# Altium schematic sheet 01_ECU V1.0 B - TOP LEVEL.SchDoc: Interface To Nvidia Orin
size A3; DrawnBy: Elio F; Engineer: Elio F; Revision: A; SheetNumber: 2; SheetTotal: 24; Sheet Title: Top Level
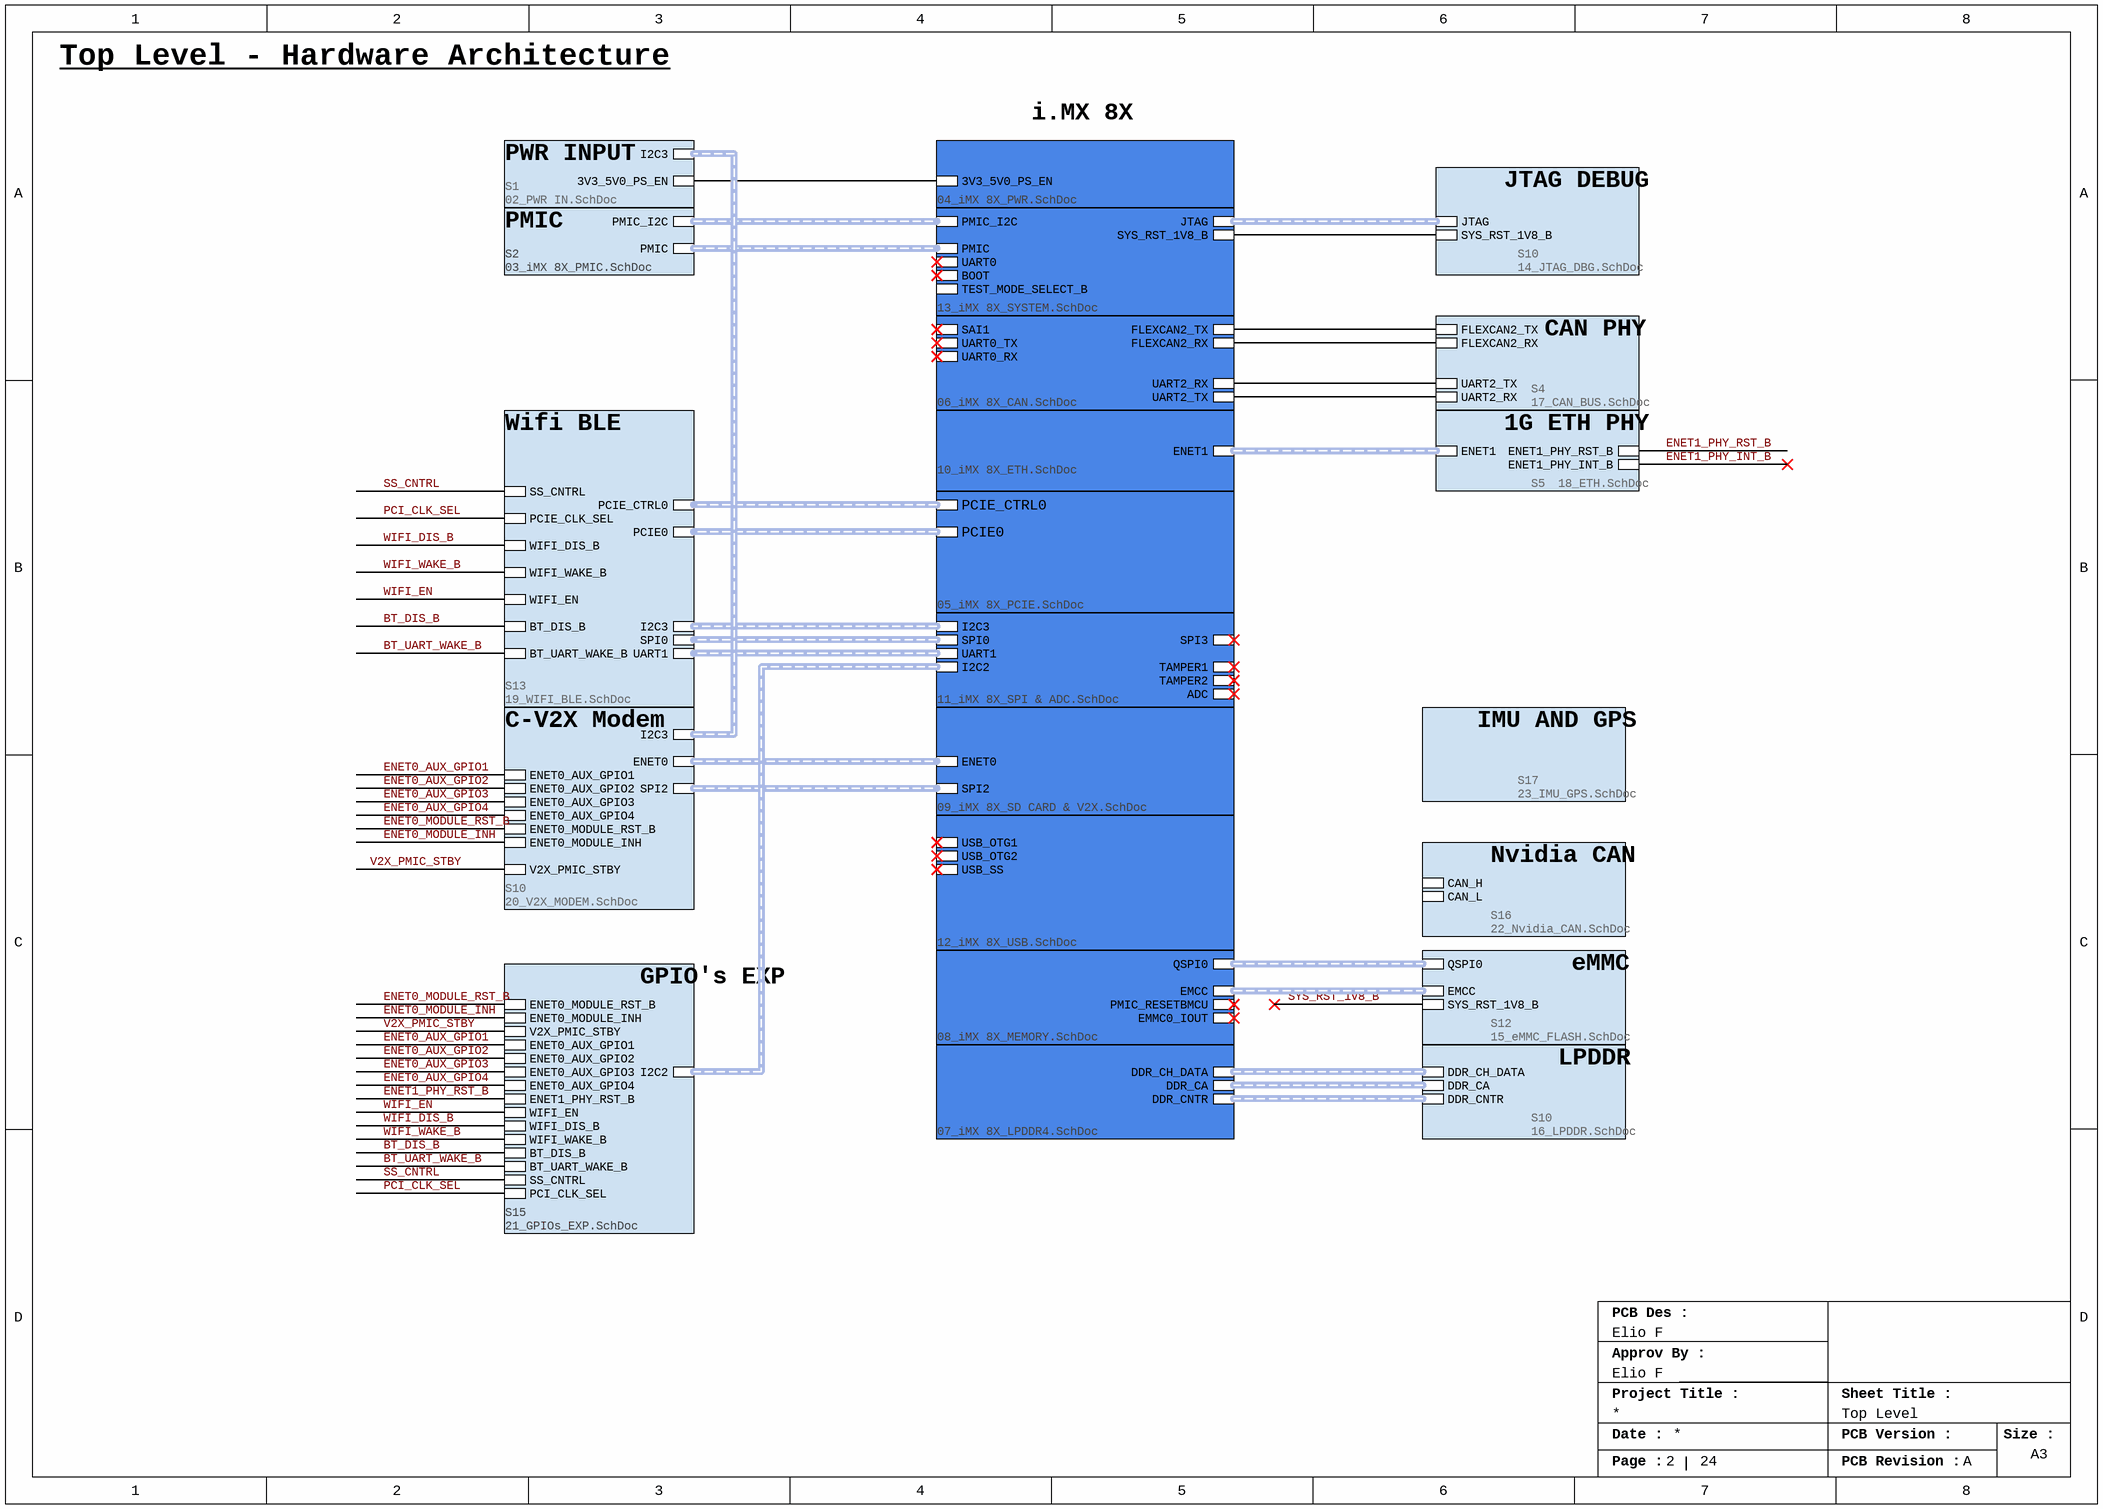
[diagram p0: 01_ECU V1.0 B - TOP LEVEL.SchDoc]

## Sub-sheets
S1 = 02_PWR IN.SchDoc: I2C3 (harness I2C3), 3V3_5V0_PS_EN
S2 = 03_iMX 8X_PMIC.SchDoc: PMIC_I2C (harness PMIC_I2C), PMIC (harness PMIC)
S3 = 04_iMX 8X_PWR.SchDoc: 3V3_5V0_PS_EN
S4 = 17_CAN_BUS.SchDoc: FLEXCAN2_TX, FLEXCAN2_RX, UART2_TX, UART2_RX
S4 = 06_iMX 8X_CAN.SchDoc: SAI1 (harness SAI1), FLEXCAN2_TX, FLEXCAN2_RX, UART0_TX, UART0_RX, UART2_TX, UART2_RX
S5 = 18_ETH.SchDoc: ENET1 (harness ENET1), ENET1_PHY_RST_B, ENET1_PHY_INT_B
S5 = 07_iMX 8X_LPDDR4.SchDoc: DDR_CH_DATA (harness DDR_CH_DATA), DDR_CA (harness DDR_CA), DDR_CNTR (harness DDR_CNTR)
S6 = 08_iMX 8X_MEMORY.SchDoc: QSPI0 (harness QSPI0), EMCC (harness EMCC), PMIC_RESETBMCU, EMMC0_IOUT
S7 = 09_iMX 8X_SD CARD & V2X.SchDoc: ENET0 (harness ENET0), SPI2 (harness SPI2)
S8 = 10_iMX 8X_ETH.SchDoc: ENET1 (harness ENET1)
S9 = 11_iMX 8X_SPI & ADC.SchDoc: SPI0 (harness SPI0), SPI3 (harness SPI3), UART1 (harness UART1), TAMPER1 (harness TAMPER1), ADC (harness ADC), TAMPER2 (harness TAMPER2), I2C2 (harness I2C2), I2C3 (harness I2C3)
S10 = 20_V2X_MODEM.SchDoc: SPI2 (harness SPI2), ENET0_AUX_GPIO1, ENET0_AUX_GPIO2, ENET0_AUX_GPIO3, ENET0_AUX_GPIO4, V2X_PMIC_STBY, ENET0_MODULE_RST_B, ENET0 (harness ENET0), ENET0_MODULE_INH, I2C3 (harness I2C3)
S10 = 16_LPDDR.SchDoc: DDR_CH_DATA (harness DDR_CH_DATA), DDR_CNTR (harness DDR_CNTR), DDR_CA (harness DDR_CA)
S10 = 14_JTAG_DBG.SchDoc: JTAG (harness JTAG), SYS_RST_1V8_B
S10 = 12_iMX 8X_USB.SchDoc: USB_OTG1 (harness USB_OTG1), USB_OTG2 (harness USB_OTG2), USB_SS (harness USB_SS)
S11 = 05_iMX 8X_PCIE.SchDoc: PCIE0 (harness PCIE0), PCIE_CTRL0 (harness PCIE_CTRL0)
S12 = 15_eMMC_FLASH.SchDoc: QSPI0 (harness QSPI0), SYS_RST_1V8_B, EMCC (harness EMCC)
S12 = 13_iMX 8X_SYSTEM.SchDoc: PMIC (harness PMIC), UART0 (harness UART0), BOOT (harness UART0), JTAG (harness JTAG), SYS_RST_1V8_B, PMIC_I2C (harness PMIC_I2C), TEST_MODE_SELECT_B
S13 = 19_WIFI_BLE.SchDoc: UART1 (harness UART1), PCIE0 (harness PCIE0), PCIE_CTRL0 (harness PCIE_CTRL0), SS_CNTRL, PCIE_CLK_SEL, WIFI_DIS_B, BT_DIS_B, WIFI_WAKE_B, WIFI_EN, BT_UART_WAKE_B, SPI0 (harness SPI0), I2C3 (harness I2C3)
S15 = 21_GPIOs_EXP.SchDoc: ENET0_MODULE_RST_B, ENET0_MODULE_INH, V2X_PMIC_STBY, I2C2 (harness I2C2), ENET0_AUX_GPIO1, ENET0_AUX_GPIO2, ENET0_AUX_GPIO3, ENET0_AUX_GPIO4, WIFI_EN, WIFI_DIS_B, WIFI_WAKE_B, BT_DIS_B, BT_UART_WAKE_B, SS_CNTRL, PCI_CLK_SEL, ENET1_PHY_RST_B
S16 = 22_Nvidia_CAN.SchDoc: CAN_H, CAN_L
S17 = 23_IMU_GPS.SchDoc: no entries

## Nets
BT_DIS_B: sheet S13/BT_DIS_B, sheet S15/BT_DIS_B
BT_UART_WAKE_B: sheet S13/BT_UART_WAKE_B, sheet S15/BT_UART_WAKE_B
ENET0_AUX_GPIO1: sheet S10/ENET0_AUX_GPIO1, sheet S15/ENET0_AUX_GPIO1
ENET0_AUX_GPIO2: sheet S10/ENET0_AUX_GPIO2, sheet S15/ENET0_AUX_GPIO2
ENET0_AUX_GPIO3: sheet S10/ENET0_AUX_GPIO3, sheet S15/ENET0_AUX_GPIO3
ENET0_AUX_GPIO4: sheet S10/ENET0_AUX_GPIO4, sheet S15/ENET0_AUX_GPIO4
ENET0_MODULE_INH: sheet S10/ENET0_MODULE_INH, sheet S15/ENET0_MODULE_INH
ENET0_MODULE_RST_B: sheet S10/ENET0_MODULE_RST_B, sheet S15/ENET0_MODULE_RST_B
ENET1_PHY_INT_B: sheet S5/ENET1_PHY_INT_B
ENET1_PHY_RST_B: sheet S5/ENET1_PHY_RST_B, sheet S15/ENET1_PHY_RST_B
PCI_CLK_SEL: sheet S13/PCIE_CLK_SEL, sheet S15/PCI_CLK_SEL
SS_CNTRL: sheet S13/SS_CNTRL, sheet S15/SS_CNTRL
SYS_RST_1V8_B: sheet S12/SYS_RST_1V8_B
V2X_PMIC_STBY: sheet S10/V2X_PMIC_STBY, sheet S15/V2X_PMIC_STBY
WIFI_DIS_B: sheet S13/WIFI_DIS_B, sheet S15/WIFI_DIS_B
WIFI_EN: sheet S13/WIFI_EN, sheet S15/WIFI_EN
WIFI_WAKE_B: sheet S13/WIFI_WAKE_B, sheet S15/WIFI_WAKE_B
(unnamed): sheet S3/3V3_5V0_PS_EN, sheet S1/3V3_5V0_PS_EN
(unnamed): sheet S4/FLEXCAN2_TX, sheet S4/FLEXCAN2_TX
(unnamed): sheet S4/FLEXCAN2_RX, sheet S4/FLEXCAN2_RX
(unnamed): sheet S4/UART2_TX, sheet S4/UART2_RX
(unnamed): sheet S4/UART2_RX, sheet S4/UART2_TX
(unnamed): sheet S10/SYS_RST_1V8_B, sheet S12/SYS_RST_1V8_B

## Buses and harness runs
harness sheet S1/I2C3 = sheet S9/I2C3 = sheet S10/I2C3 = sheet S13/I2C3
harness sheet S2/PMIC = sheet S12/PMIC
harness sheet S2/PMIC_I2C = sheet S12/PMIC_I2C
harness sheet S5/DDR_CA = sheet S10/DDR_CA
harness sheet S5/DDR_CH_DATA = sheet S10/DDR_CH_DATA
harness sheet S5/DDR_CNTR = sheet S10/DDR_CNTR
harness sheet S5/ENET1 = sheet S8/ENET1
harness sheet S6/EMCC = sheet S12/EMCC
harness sheet S6/QSPI0 = sheet S12/QSPI0
harness sheet S7/ENET0 = sheet S10/ENET0
harness sheet S7/SPI2 = sheet S10/SPI2
harness sheet S9/I2C2 = sheet S15/I2C2
harness sheet S9/SPI0 = sheet S13/SPI0
harness sheet S9/UART1 = sheet S13/UART1
harness sheet S10/JTAG = sheet S12/JTAG
harness sheet S11/PCIE0 = sheet S13/PCIE0
harness sheet S11/PCIE_CTRL0 = sheet S13/PCIE_CTRL0

## Notes on the sheet
- Top Level - Hardware Architecture
- PWR INPUT
- i.MX 8X
- PMIC
- JTAG DEBUG
- CAN PHY
- Wifi BLE
- 1G ETH PHY
- C-V2X Modem
- IMU AND GPS
- Nvidia CAN
- GPIO's EXP
- eMMC
- LPDDR
- PCB Des :
- Approv By :
- Project Title :
- Sheet Title :
- Date :
- PCB Version :
- Size :
- A3
- Page :
- PCB Revision :